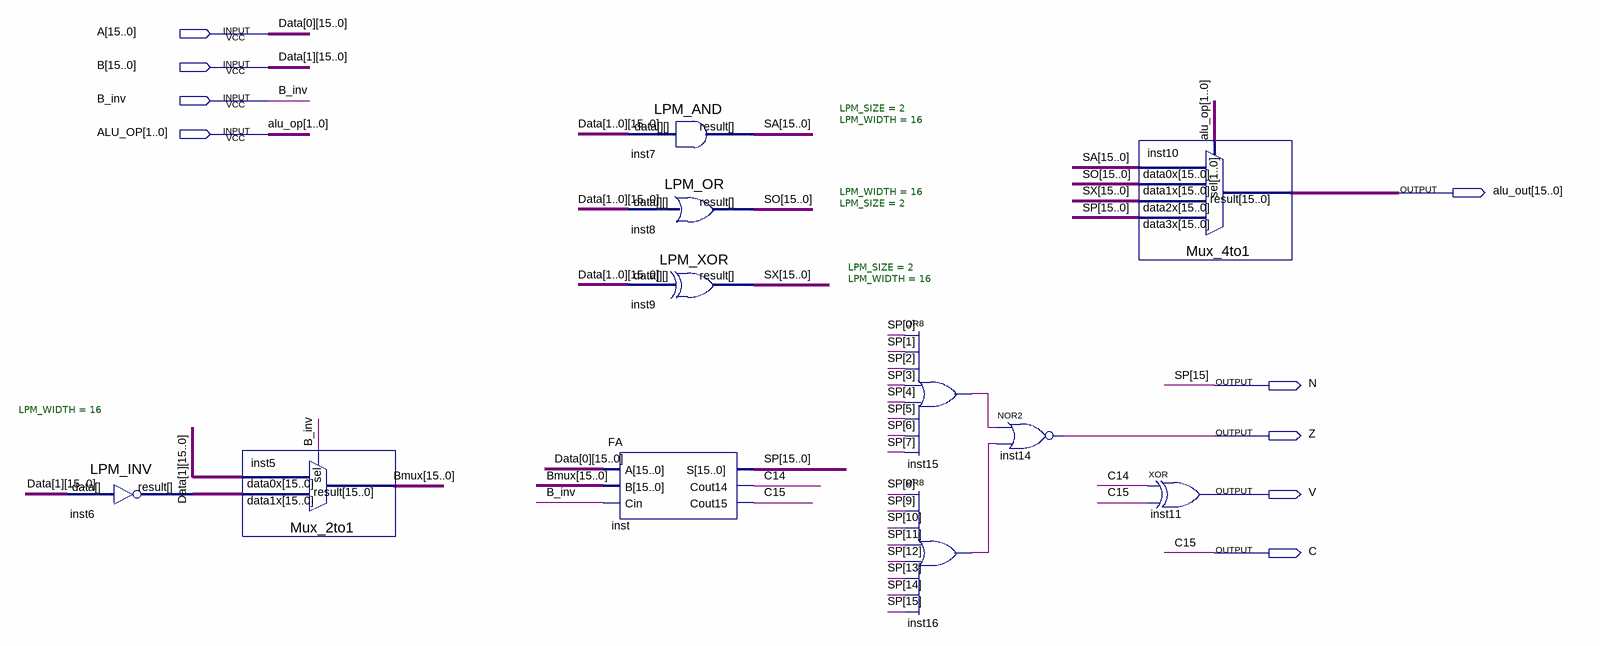
[diagram p0: schematic sheet]
// Quartus schematic ALU.bdf as structural Verilog: 11 symbols, 9 pins
module ALU (
  input  [15:0] A,
  input  [15:0] B,
  input  B_inv,
  input  [1:0] ALU_OP,
  output [15:0] alu_out,
  output N,
  output Z,
  output V,
  output C
);

  wire C14, inst15_out, inst16_out;
  wire [14:0] SP;
  wire [15:0] Bmux, inst6_result, SA, SO, SX;

  LPM_INV #(.LPM_WIDTH(16)) inst6 (.data(B), .result(inst6_result));
  Mux_2to1 inst5 (.data1x(inst6_result), .data0x(B), .sel(B_inv), .result(Bmux));
  LPM_AND #(.LPM_SIZE(2), .LPM_WIDTH(16)) inst7 (.data({B, A}), .result(SA));
  LPM_OR #(.LPM_WIDTH(16), .LPM_SIZE(2)) inst8 (.data({B, A}), .result(SO));
  LPM_XOR #(.LPM_SIZE(2), .LPM_WIDTH(16)) inst9 (.data({B, A}), .result(SX));
  FA inst (.A(A), .B(Bmux), .Cin(B_inv), .S({N, SP}), .Cout14(C14), .Cout15(C));
  or inst15 (inst15_out, SP[0], SP[1], SP[2], SP[3], SP[4], SP[5], SP[6], SP[7]);
  or inst16 (inst16_out, SP[8], SP[9], SP[10], SP[11], SP[12], SP[13], SP[14], N);
  nor inst14 (Z, inst15_out, inst16_out);
  Mux_4to1 inst10 (.data3x({N, SP}), .data2x(SX), .data1x(SO), .data0x(SA), .sel(ALU_OP), .result(alu_out));
  xor inst11 (V, C14, C);

  // Other names for the same wires on the sheet: C15 = C; Data_0[15:0] = A; Data_1[15:0] = B; SP[15] = N
endmodule
